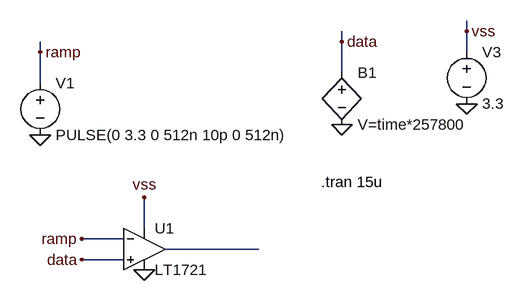
[diagram p0: schematic digital_To_PWM_test.asc]
digital_To_PWM_test.asc, the LTspice schematic file:
Version 4
SHEET 1 1116 680
WIRE 832 160 832 144
WIRE 640 176 640 160
WIRE 176 192 176 176
WIRE 832 192 832 160
WIRE 640 224 640 176
WIRE 176 240 176 192
WIRE 336 464 336 416
WIRE 304 480 240 480
WIRE 512 496 368 496
WIRE 304 512 240 512
FLAG 176 320 0
FLAG 176 192 ramp
FLAG 640 304 0
FLAG 640 176 data
FLAG 336 528 0
FLAG 832 272 0
FLAG 832 160 vss
FLAG 336 416 vss
FLAG 240 480 ramp
FLAG 240 512 data
SYMBOL voltage 176 224 R0
SYMATTR InstName V1
SYMATTR Value PULSE(0 3.3 0 512n 10p 0 512n)
SYMBOL LT1721 336 432 R0
SYMATTR InstName U1
SYMBOL Voltage 832 176 R0
SYMATTR InstName V3
SYMATTR Value 3.3
SYMBOL bv 640 208 R0
SYMATTR InstName B1
SYMATTR Value V=time*257800
TEXT 608 392 Left 2 !.tran 15u

The netlist it stands for:
* digital_To_PWM_test.asc
V1 ramp 0 PULSE(0 3.3 0 512n 10p 0 512n)
XU1 data ramp vss 0 N001 LT1720  ; LT1721, pins In+ In- V+ V- OUT
V3 vss 0 3.3
B1 data 0 V=time*257800
.tran 15u
.lib LTC.lib
.backanno
.end